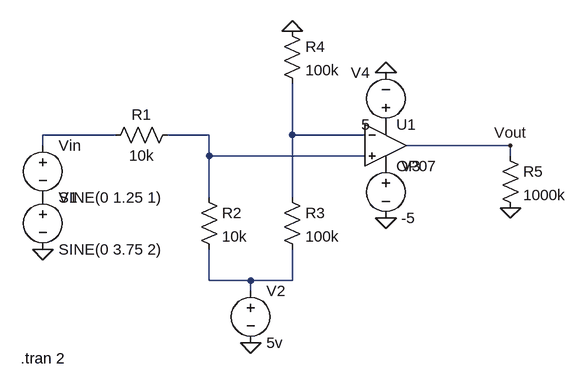
[diagram p0: schematic ThresholdCircuit.asc]
ThresholdCircuit.asc, the LTspice schematic file:
Version 4
SHEET 1 880 680
WIRE 160 112 48 112
WIRE 304 112 240 112
WIRE 432 112 432 32
WIRE 544 112 432 112
WIRE 48 128 48 112
WIRE 768 128 608 128
WIRE 304 144 304 112
WIRE 544 144 304 144
WIRE 768 144 768 128
WIRE 304 208 304 144
WIRE 432 208 432 112
WIRE 304 336 304 288
WIRE 368 336 304 336
WIRE 432 336 432 288
WIRE 432 336 368 336
WIRE 368 352 368 336
FLAG 432 -48 0
FLAG 368 432 0
FLAG 576 240 0
FLAG 576 16 0
FLAG 768 224 0
FLAG 768 128 Vout
FLAG 48 288 0
SYMBOL voltage 48 112 R0
WINDOW 123 0 0 Left 0
WINDOW 39 0 0 Left 0
SYMATTR InstName Vin
SYMATTR Value SINE(0 1.25 1)
SYMBOL res 256 96 R90
WINDOW 0 0 56 VBottom 2
WINDOW 3 32 56 VTop 2
SYMATTR InstName R1
SYMATTR Value 10k
SYMBOL res 288 192 R0
SYMATTR InstName R2
SYMATTR Value 10k
SYMBOL res 416 192 R0
SYMATTR InstName R3
SYMATTR Value 100k
SYMBOL OpAmps\\OP07 576 64 R0
SYMATTR InstName U1
SYMBOL voltage 368 336 R0
SYMATTR InstName V2
SYMATTR Value 5v
SYMBOL voltage 576 144 R0
SYMATTR InstName V3
SYMATTR Value -5
SYMBOL voltage 576 112 R180
WINDOW 0 24 96 Left 2
WINDOW 3 24 16 Left 2
SYMATTR InstName V4
SYMATTR Value 5
SYMBOL res 416 -64 R0
SYMATTR InstName R4
SYMATTR Value 100k
SYMBOL res 752 128 R0
SYMATTR InstName R5
SYMATTR Value 1000k
SYMBOL voltage 48 192 R0
WINDOW 123 0 0 Left 0
WINDOW 39 0 0 Left 0
SYMATTR InstName V1
SYMATTR Value SINE(0 3.75 2)
TEXT 14 456 Left 2 !.tran 2

The netlist it stands for:
* ThresholdCircuit.asc
Vin N001 P001 SINE(0 1.25 1)
R1 N002 N001 10k
R2 N002 N004 10k
R3 N003 N004 100k
XU1 N002 N003 P002 P003 Vout LT1001  ; OP07, pins In+ In- V+ V- OUT
V2 N004 0 5v
V3 P003 0 -5
V4 P002 0 5
R4 0 N003 100k
R5 Vout 0 1000k
V1 P001 0 SINE(0 3.75 2)
.tran 2
.lib LTC.lib
.backanno
.end